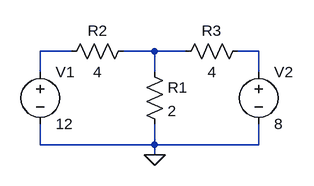
[diagram p0: schematic Circuit_5.asc]
Circuit_5.asc, the LTspice schematic file:
Version 4.1
SHEET 1 880 680
WIRE 96 96 48 96
WIRE 224 96 176 96
WIRE 272 96 224 96
WIRE 384 96 352 96
WIRE 48 128 48 96
WIRE 224 128 224 96
WIRE 384 128 384 96
WIRE 48 240 48 208
WIRE 224 240 224 208
WIRE 224 240 48 240
WIRE 384 240 384 208
WIRE 384 240 224 240
WIRE 224 256 224 240
FLAG 224 256 0
SYMBOL voltage 48 112 R0
WINDOW 123 0 0 Left 0
WINDOW 39 0 0 Left 0
SYMATTR InstName V1
SYMATTR Value 12
SYMBOL voltage 384 112 R0
WINDOW 123 0 0 Left 0
WINDOW 39 0 0 Left 0
SYMATTR InstName V2
SYMATTR Value 8
SYMBOL res 208 112 R0
SYMATTR InstName R1
SYMATTR Value 2
SYMBOL res 192 80 R90
WINDOW 0 0 56 VBottom 2
WINDOW 3 32 56 VTop 2
SYMATTR InstName R2
SYMATTR Value 4
SYMBOL res 368 80 R90
WINDOW 0 0 56 VBottom 2
WINDOW 3 32 56 VTop 2
SYMATTR InstName R3
SYMATTR Value 4

The netlist it stands for:
* Circuit_5.asc
V1 N001 0 12
V2 N003 0 8
R1 N002 0 2
R2 N002 N001 4
R3 N003 N002 4
.backanno
.end